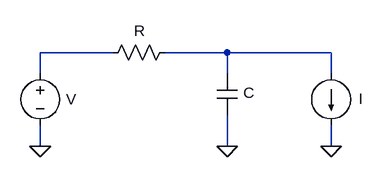
[diagram p0: schematic Schema.asc]
Schema.asc, the LTspice schematic file:
Version 4
SHEET 1 880 680
WIRE 80 128 -32 128
WIRE 256 128 160 128
WIRE 416 128 256 128
WIRE -32 160 -32 128
WIRE 256 160 256 128
WIRE 416 160 416 128
WIRE -32 272 -32 240
WIRE 256 272 256 224
WIRE 416 272 416 240
FLAG -32 272 0
FLAG 256 272 0
FLAG 416 272 0
SYMBOL res 176 112 R90
WINDOW 0 0 56 Invisible 2
WINDOW 3 -33 55 VTop 2
SYMATTR InstName R1
SYMBOL cap 240 224 M180
WINDOW 0 24 56 Invisible 2
WINDOW 3 41 34 Left 2
SYMATTR InstName C1
SYMBOL voltage -32 144 R0
WINDOW 0 24 16 Invisible 2
WINDOW 3 40 56 Left 2
SYMATTR InstName V1
SYMBOL current 416 160 R0
WINDOW 0 24 0 Invisible 2
WINDOW 3 43 39 Left 2
SYMATTR InstName I1

The netlist it stands for:
* Schema.asc
R1 N002 N001 R
C1 0 N002 C
V1 N001 0 V
I1 N002 0 I
.backanno
.end